# Altium project WS7.820.446.V01.PrjPCB
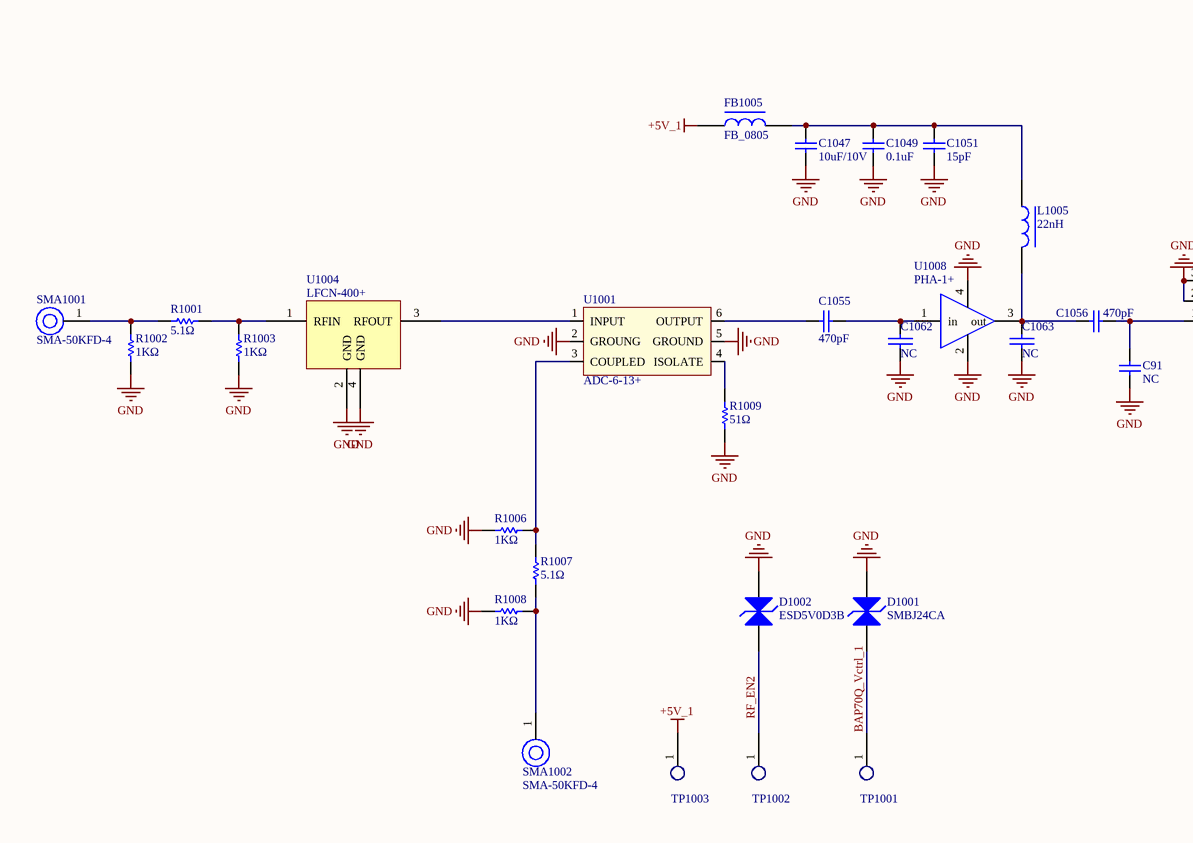
[diagram p0: 1-RF-S.SchDoc, left]
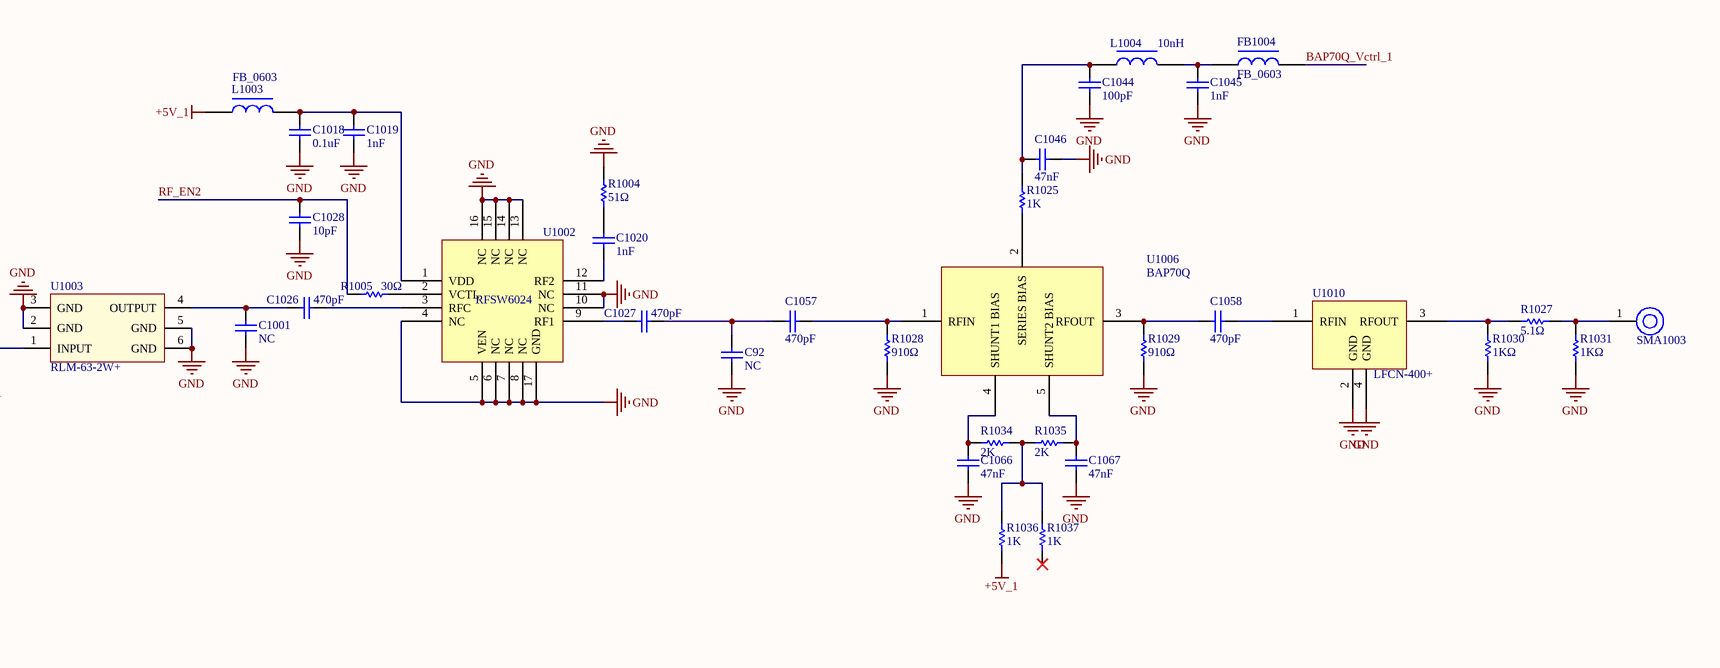
[diagram p1: 1-RF-S.SchDoc, right]
1 sheet, 62 parts. Net scope: global (net labels, ports and power ports of the same name join across sheets).
Board file: WS7.820.446.V01.PcbDoc

## Sheet 1-RF-S.SchDoc
size A2

### Parts
C91  NC  [C0805]  (no BOM)
C92  NC  [C0805]  (no BOM)
C1001  NC  [C0805]  (no BOM)
C1018  0.1uF  [C0603]
C1019  1nF  [C0603]
C1020  1nF  [C0603]
C1026  470pF  [C0805]
C1027  470pF  [C0805]
C1028  10pF  [C0603]
C1044  100pF  [C0603]
C1045  1nF  [C0603]
C1046  47nF  [C0603]
C1047  10uF/10V  [C0805]
C1049  0.1uF  [C0805]
C1051  15pF  [C0805]
C1055  470pF  [C0805]
C1056  470pF  [C0805]
C1057  470pF  [C0805]
C1058  470pF  [C0805]
C1062  NC  [C0805]  (no BOM)
C1063  NC  [C0805]  (no BOM)
C1066  47nF  [C0603]
C1067  47nF  [C0603]
D1001  SMBJ24CA  [DO-214AA]
D1002  ESD5V0D3B  [SOD-323]
FB1004  FB_0603  [L0603]
FB1005  FB_0805  [L0805]
L1003  FB_0603  [L0603]
L1004  10nH  [L0603]
L1005  22nH  [L0805]
R1001  5.1Ω  [R0805]
R1002  1KΩ  [R0805]
R1003  1KΩ  [R0805]
R1004  51Ω  [R0603]
R1005  30Ω  [R0603]
R1006  1KΩ  [R0805]
R1007  5.1Ω  [R0805]
R1008  1KΩ  [R0805]
R1009  51Ω  [R0805]
R1025  1K  [R0603]
R1027  5.1Ω  [R0805]
R1028  910Ω  [R0805]
R1029  910Ω  [R0805]
R1030  1KΩ  [R0805]
R1031  1KΩ  [R0805]
R1034  2K  [R0603]
R1035  2K  [R0603]
R1036  1K  [R0603]
R1037  1K  [R0603]
SMA1001  SMA-50KFD-4  [SMA-50KFD-4]  (no BOM)
SMA1002  SMA-50KFD-4  [SMA-50KFD-4]  (no BOM)
SMA1003  SMA-50KFD-4  [SMA-50KFD-4]  (value not drawn)  (no BOM)
TP1001  TEST  [FC-M4]  (value not drawn)  (no BOM)
TP1002  TEST  [FC-M4]  (value not drawn)  (no BOM)
TP1003  TEST  [FC-M4]  (value not drawn)  (no BOM)
U1001  ADC-6-13+  [6SM-2R54-7R87X5R59]
U1002  RFSW6024  [QFN16_0R65_4X4-1]
U1003  RLM-63-2W+  [6SM-2R54-7R87X6R35]
U1004  LFCN-400+  [LFCN-3216]
U1006  BAP70Q  [SOT23-5]
U1008  PHA-1+  [SOT-89]
U1010  LFCN-400+  [LFCN-3216]

### Nets
+5V_1: FB1005.1 L1003.1 R1036.1 TP1003.1(TP)
GND: C91.2 C92.1 C1001.2 C1018.2 C1019.1 C1028.1 C1044.1 C1045.1 C1046.1 C1047.1 C1049.1 C1051.1 C1062.1 C1063.1 C1066.1 C1067.1 D1001.1 D1002.2 R1002.1 R1003.1 R1004.2 R1006.1 R1008.1 R1009.2 R1028.1 R1029.1 R1030.1 R1031.1 U1001.2(GROUNG) U1001.5(GROUND) U1002.4(NC) U1002.5(VEN) U1002.6(NC) U1002.7(NC) U1002.8(NC) U1002.10(NC) U1002.11(NC) U1002.13(NC) U1002.14(NC) U1002.15(NC) U1002.16(NC) U1002.17(GND) U1003.2(GND) U1003.3(GND) U1003.5(GND) U1003.6(GND) U1004.2(GND) U1004.4(GND) U1008.2 U1008.4 U1010.2(GND) U1010.4(GND)
BAP70Q_Vctrl_1: D1001.2 FB1004.2 TP1001.1(TP)
RF_EN2: C1028.2 D1002.1 R1005.1 TP1002.1(TP)
NetC91_1: C91.1 C1056.2 U1003.1(INPUT)
NetC92_2: C92.2 C1027.2 C1057.1
NetC1001_1: C1001.1 C1026.1 U1003.4(OUTPUT)
NetC1018_1: C1018.1 C1019.2 L1003.2 U1002.1(VDD)
NetC1020_1: C1020.1 U1002.12(RF2)
NetC1020_2: C1020.2 R1004.1
NetC1026_2: C1026.2 U1002.3(RFC)
NetC1027_1: C1027.1 U1002.9(RF1)
NetC1044_2: C1044.2 C1046.2 L1004.1 R1025.2
NetC1045_2: C1045.2 FB1004.1 L1004.2
NetC1047_2: C1047.2 C1049.2 C1051.2 FB1005.2 L1005.1
NetC1055_1: C1055.1 U1001.6(OUTPUT)
NetC1055_2: C1055.2 C1062.2 U1008.1(in)
NetC1056_1: C1056.1 C1063.2 L1005.2 U1008.3(out)
NetC1057_2: C1057.2 R1028.2 U1006.1(RFIN)
NetC1058_1: C1058.1 R1029.2 U1006.3(RFOUT)
NetC1058_2: C1058.2 U1010.1(RFIN)
NetC1066_2: C1066.2 R1034.1 U1006.4(SHUNT1_BIAS)
NetC1067_2: C1067.2 R1035.2 U1006.5(SHUNT2_BIAS)
NetR1001_1: R1001.1 R1002.2 SMA1001.1(Sig)
NetR1001_2: R1001.2 R1003.2 U1004.1(RFIN)
NetR1005_2: R1005.2 U1002.2(VCTL)
NetR1006_2: R1006.2 R1007.1 U1001.3(COUPLED)
NetR1007_2: R1007.2 R1008.2 SMA1002.1(Sig)
NetR1009_1: R1009.1 U1001.4(ISOLATE)
NetR1025_1: R1025.1 U1006.2(SERIES_BIAS)
NetR1027_1: R1027.1 R1030.2 U1010.3(RFOUT)
NetR1027_2: R1027.2 R1031.2 SMA1003.1(Sig)
NetR1034_2: R1034.2 R1035.1 R1036.2 R1037.2
NetU1001_1: U1001.1(INPUT) U1004.3(RFOUT)

Not connected (* = marked no-connect by the designer): R1037 1*

### Library data of the parts
C91 C92 C1001 C1026 C1027 = 10pF贴片电容: 贴片电容_GRM215C1H100JA01D_10pF±5%,50V,0805; code: 01010097
C1018 = 0.1uF贴片电容: 贴片电容_GRM188R71H104KA01D_0.1uF±10%,50V,0603; code: 01010045
C1019 C1020 = 1000pF贴片电容: 贴片电容_GRM188R71H102KA01_1000pF±10%,50V,0603; code: 01010093
C1028 = 10pF贴片电容: 贴片电容_0603CG100J500NT_10pF±5%,50V,0603; code: 01010001
C1044 C1045 = 100pF贴片电容: 贴片电容_GRM185C1H101K_100pF±10%,50V,0603
C1046 C1066 C1067 = 47nF贴片电容: 贴片电容_GRM1885C1H473KA01D_47nF±10 %,50V,0603; code: 01010080
C1047 = 10uF贴片电容: 贴片电容_GRM21BR61A106KE19L_10uF±10%,10V,0805; code: 01010036
C1049 = 100nF贴片电容: 贴片电容_GRM21BR71E104KA01L_100nF±10%,25V,0805; code: 03030016
C1051 = 15pF贴片电容: 贴片电容_GRM2165C1H150JA01D_15pF±5%,50V,0805; code: 01010024
C1055 = 1pF贴片电容: 贴片电容_GRM2165C1H1R0CA01D_1pF±0.25F,50V,0805
C1056 = 3pF贴片电容: 贴片电容_GRM2165C1H3R0DD47D_3pF±0.5pF%,50V,0805
C1057 C1058 = 100pF贴片电容: 贴片电容_GRM2165C1H101JA01D_100pF±5%,50V,0805
C1062 C1063 = DLC_0.5pF: 普通电容
D1001 = SMBJ12CA: TVS_SMBJ24CA_SMB封装
D1002 = ESD5B5.0ST1G: ESD_ESD5V0D3B_SOD-323,5V,双管
FB1004 = 0603贴片磁珠: 贴片磁珠_100R,0603; code: 0103016
FB1005 = 0805贴片磁珠: 贴片磁珠_600R,0805; code: 01030023
L1003 = 0805贴片磁珠
L1004 = 3.3nH贴片电感: 贴片电感_3.3nH,0603
L1005 = 22nH贴片电感: 贴片电感_22nH,0805; code: 01030016
R1001 R1007 R1027 = 18Ω贴片电阻: 贴片电阻_0805,5.1Ω,±1％; code: 1.02.01.131
R1002 R1003 R1006 R1008 R1030 R1031 = 300Ω贴片电阻: 贴片电阻_0805,1KΩ,±5％; code: 1.02.01.108
R1004 = 51Ω贴片电阻: 贴片电阻_51Ω±5%,0603; code: 01020009
R1005 = 30Ω贴片电阻: 贴片电阻_30Ω±5%,0603; code: 01020108
R1009 = 51Ω贴片电阻: 贴片电阻_51Ω±5%,0805; code: 01020023
R1025 R1036 R1037 = 1K贴片电阻: 贴片电阻_1K±5%,0603; code: 01020082
R1028 R1029 = 910Ω贴片电阻: 贴片电阻_910Ω±5%,0805; code: 01020061
R1034 R1035 = 2K贴片电阻: 贴片电阻_2K±5%,0603; code: 01020086
SMA1001-SMA1003 = SMA-50KFD-4: 射频同轴连接器_SMA-50KFD-4; code: 03100009
TP1001-TP1003 = TP1mm: 表贴测试点1mm
U1001 = ADC-6-1R+: 50Ω,5 to200MHz
U1002 = RFSW6124: Maker: RFMD
U1003 = RLM-63-2W+: 50Ω,30 to6000MHz
U1004 U1010 = LFCN-2500+: 滤波器_LFCN-2500+_DC~2500MHz,3216; code: 0306016
U1006 = BAP70Q: 二极管衰减器_BAP70Q_300kHz ~4GHz,SOT753; code: 03020009; Maker: NXP
U1008 = PHA-1+: 功率放大管_PHA-1+_0.05-6GHz,SOT89; Maker: Minicircuits; code: 01060123